# Altium project ResistorBoard.PrjPcb
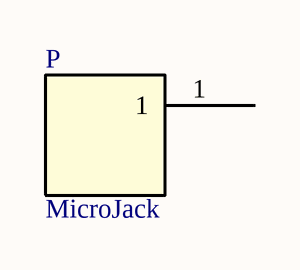
[diagram p0: ResistorBoard.SchDoc]
1 sheet, 1 parts. Net scope: global (net labels, ports and power ports of the same name join across sheets).
Board file: ResistorBoard.PcbDoc

## Sheet ResistorBoard.SchDoc
size A

### Parts
P  MicroJack  [MicroJack_1682 - 24 times]

### Nets

Not connected (* = marked no-connect by the designer): P 1